# EAGLE design driver (EAGLE 6.6.0)
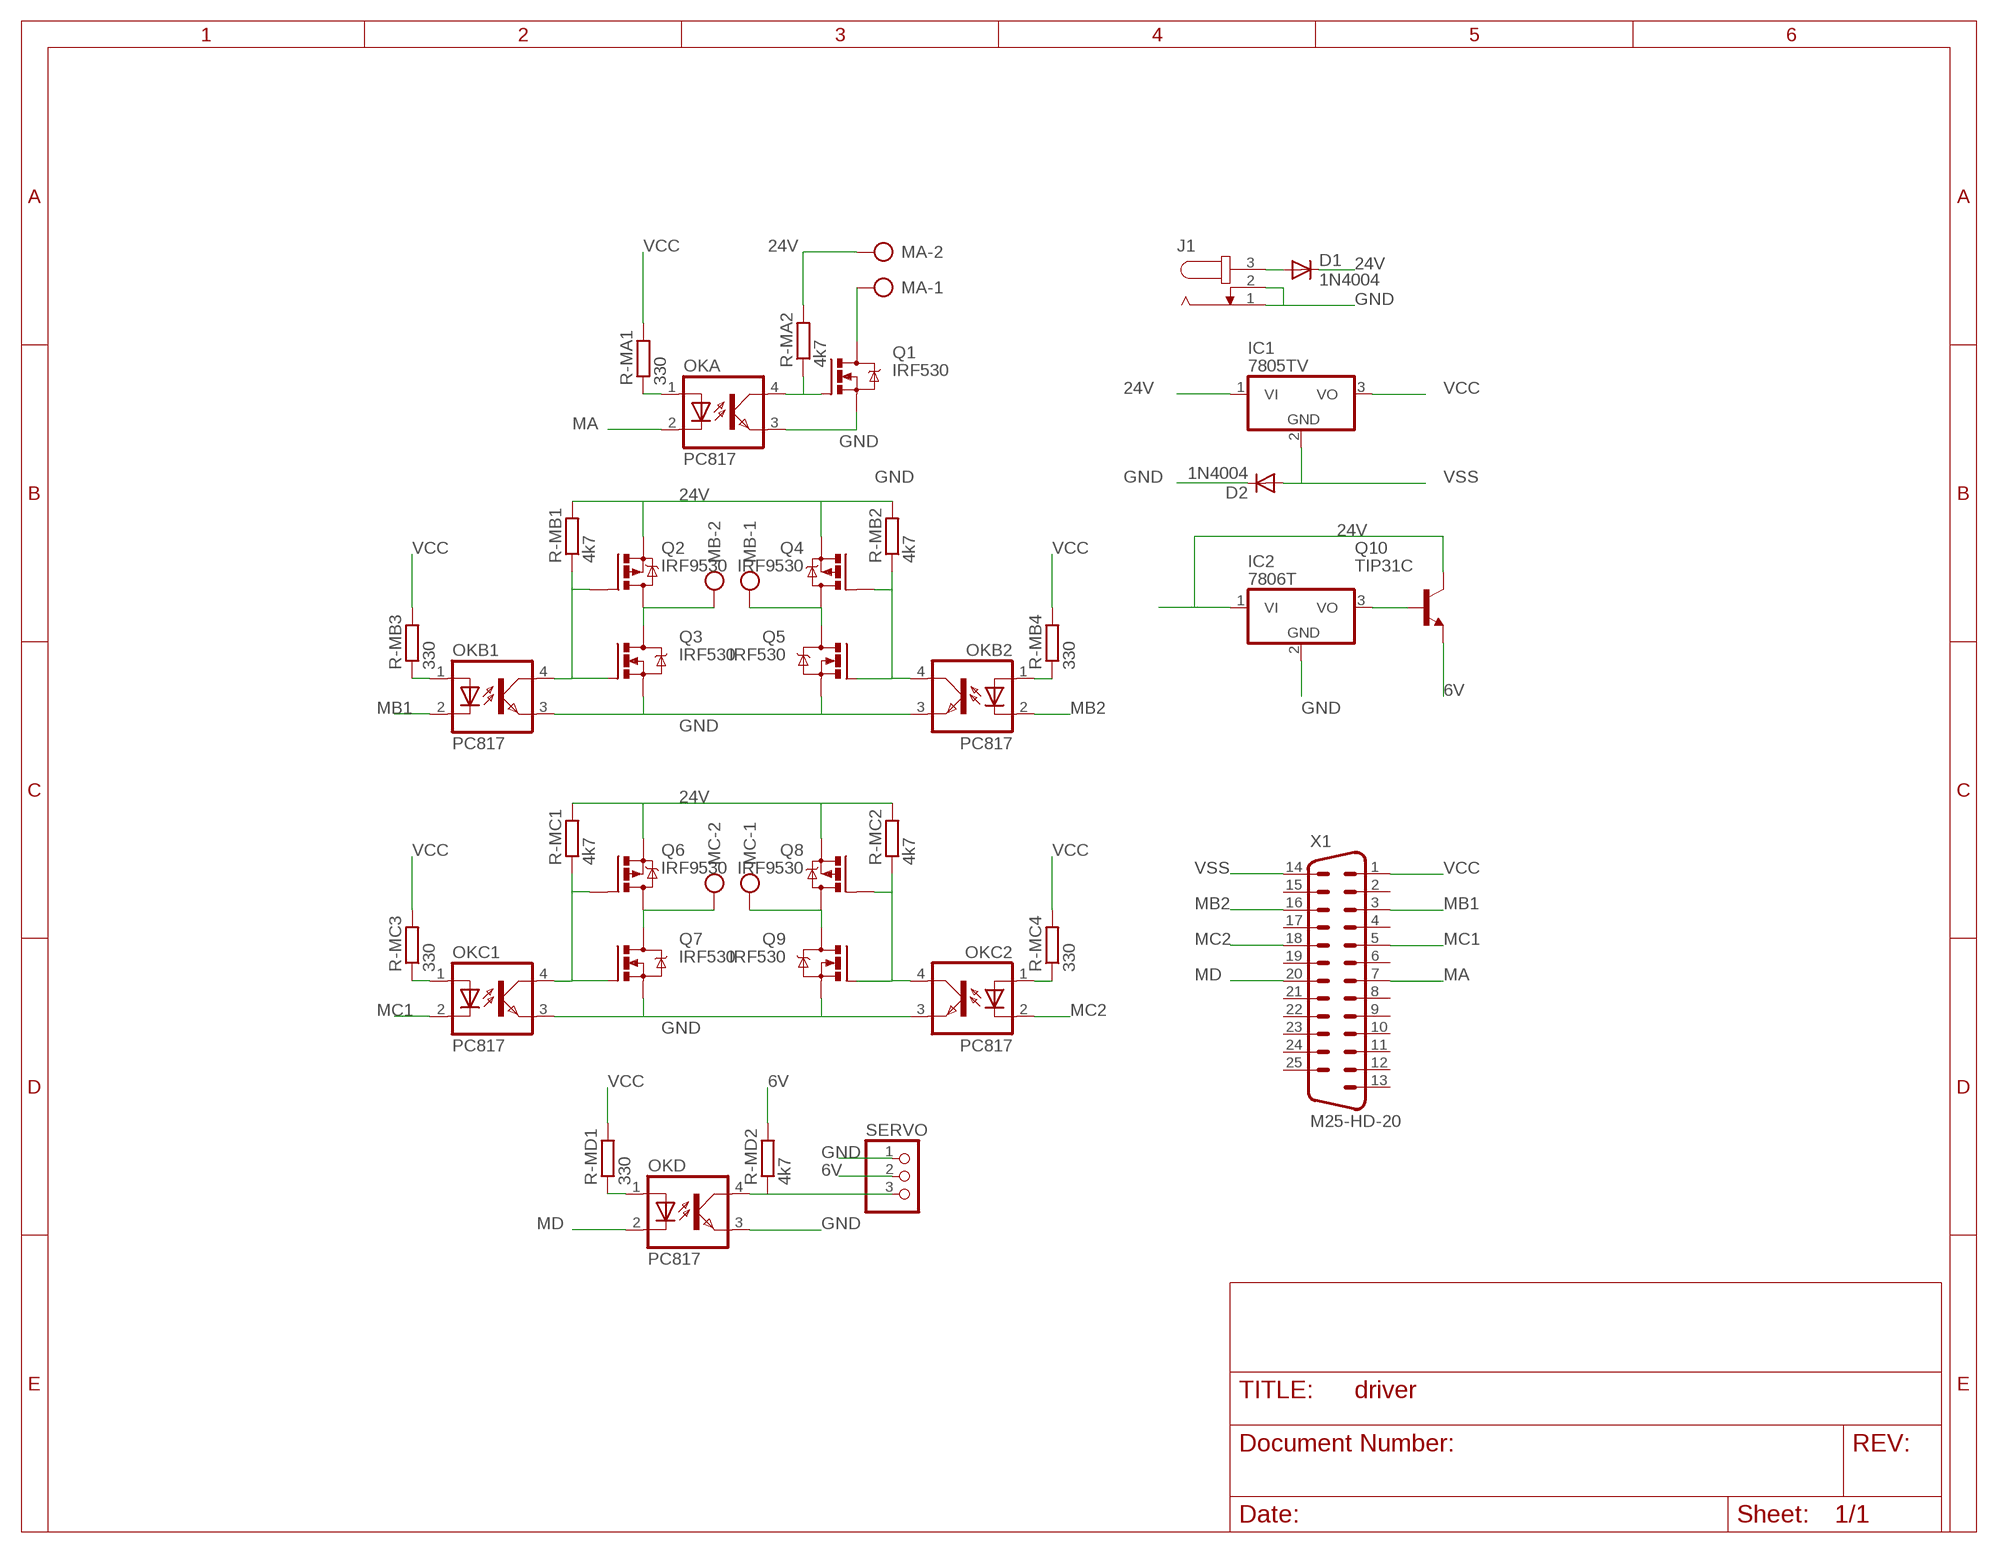
[diagram p0: schematic, sheet 1]

## Parts
D1  1N4004  [DO41-10]
D2  1N4004  [DO41-10]
IC1  7805TV  [TO220V]
IC2  7806T  [TO220H]
J1  JACK-PLUG0  [SPC4077]
MA  AK500/2  [AK500/2]
MB  AK500/2  [AK500/2]
MC  AK500/2  [AK500/2]
OKA  PC817  [DIL04]
OKB1  PC817  [DIL04]
OKB2  PC817  [DIL04]
OKC1  PC817  [DIL04]
OKC2  PC817  [DIL04]
OKD  PC817  [DIL04]
Q1  IRF530  [TO220BV]
Q2  IRF9530  [TO220BV]
Q3  IRF530  [TO220BV]
Q4  IRF9530  [TO220BV]
Q5  IRF530  [TO220BV]
Q6  IRF9530  [TO220BV]
Q7  IRF530  [TO220BV]
Q8  IRF9530  [TO220BV]
Q9  IRF530  [TO220BV]
Q10  TIP31C  [TO220]
R-MA1  330  R-EU_0204/7  [0204/7]
R-MA2  4k7  R-EU_0204/7  [0204/7]
R-MB1  4k7  R-EU_0204/7  [0204/7]
R-MB2  4k7  R-EU_0204/7  [0204/7]
R-MB3  330  R-EU_0204/7  [0204/7]
R-MB4  330  R-EU_0204/7  [0204/7]
R-MC1  4k7  R-EU_0204/7  [0204/7]
R-MC2  4k7  R-EU_0204/7  [0204/7]
R-MC3  330  R-EU_0204/7  [0204/7]
R-MC4  330  R-EU_0204/7  [0204/7]
R-MD1  330  R-EU_0204/7  [0204/7]
R-MD2  4k7  R-EU_0204/7  [0204/7]
SERVO  PINHD-1X3  [1X03]
X1  M25-HD-20  [M25-HD-20]

## Nets
6V: Q10.3(E) R-MD2.2 SERVO.2
24V: D1.C IC1.1(VI) IC2.1(VI) MA.2 Q2.S Q4.S Q6.S Q8.S Q10.2(C) R-MA2.2 R-MB1.2 R-MB2.2 R-MC1.2 R-MC2.2
GND: D2.C IC2.2(GND) J1.1 J1.2 OKA.3(EMIT) OKB1.3(EMIT) OKB2.3(EMIT) OKC1.3(EMIT) OKC2.3(EMIT) OKD.3(EMIT) Q1.S Q3.S Q5.S Q7.S Q9.S SERVO.1
MA: OKA.2(C) X1.7
MB1: OKB1.2(C) X1.3
MB2: OKB2.2(C) X1.16
MC1: OKC1.2(C) X1.5
MC2: OKC2.2(C) X1.18
MD: OKD.2(C) X1.20
MD-SERVO: OKD.4(COL) R-MD2.1 SERVO.3
N$1: OKA.4(COL) Q1.G R-MA2.1
N$2: OKA.1(A) R-MA1.1
N$3: MB.2 Q2.D Q3.D
N$4: MA.1 Q1.D
N$5: MB.1 Q4.D Q5.D
N$6: OKB1.1(A) R-MB3.1
N$7: OKB2.1(A) R-MB4.1
N$8: MC.2 Q6.D Q7.D
N$9: OKB2.4(COL) Q4.G Q5.G R-MB2.1
N$10: OKB1.4(COL) Q2.G Q3.G R-MB1.1
N$11: MC.1 Q8.D Q9.D
N$12: OKC2.4(COL) Q8.G Q9.G R-MC2.1
N$13: OKC1.4(COL) Q6.G Q7.G R-MC1.1
N$14: OKC1.1(A) R-MC3.1
N$15: OKC2.1(A) R-MC4.1
N$16: OKD.1(A) R-MD1.1
N$17: D1.A J1.3
N$19: IC2.3(VO) Q10.1(B)
VCC: IC1.3(VO) R-MA1.2 R-MB3.2 R-MB4.2 R-MC3.2 R-MC4.2 R-MD1.2 X1.1
VSS: D2.A IC1.2(GND) X1.14
Unconnected: X1.2 X1.4 X1.6 X1.8 X1.9 X1.10 X1.11 X1.12 X1.13 X1.15 X1.17 X1.19 X1.21 X1.22 X1.23 X1.24 X1.25

## Library data of the parts
D1 D2 = adafruit2:1N4004: DIODE General purpose 1N400x type rectifier (With bigger pads) http://www.ladyada.net/library/pcb/eaglelibrary.html
IC1 IC2 = linear:78*: Positive VOLTAGE REGULATOR Source: http://cache.national.com/ds/LM/LM78L05.pdf http://www.fairchildsemi.com/ds/LM/LM7805.pdf
J1 = con-jack:JACK-PLUG: DC POWER JACK Power Jack, DC, Right Angle, Through Hole, Rated 5A at 16VDC, PC Terminals Distributor: Farnell (www.Farnell.de) Drawing: 84N1161.pdf / 84N1162.pdf Manufacturer: SPC Technology (www.spctechnology.com) Type: SPC4077 / SPC 4078; OC_FARNELL: unknown; OC_NEWARK: unknown
MA MB MC = con-ptr500:AK500/2: CONNECTOR; OC_FARNELL: unknown; OC_NEWARK: unknown
OKA OKB1 OKB2 OKC1 OKC2 OKD = optocoupler:PC817: SHARP OPTO COUPLER; MPN: PC817X4J000F; OC_FARNELL: 9707727; OC_NEWARK: 97K7059
Q1 Q3 Q5 Q7 Q9 = transistor-power:IRF530: HEXFET Power MOSFET
Q2 Q4 Q6 Q8 = transistor-power:IRF9530: P-CHANNEL HEXFET POWER-MOS-FET Source: http://www.irf.com/product-info/datasheets/data/irf9530.pdf
Q10 = transistor-npn:TIP31C*: NPN Transistor
R-MA1 R-MA2 R-MB1-R-MB4 R-MC1-R-MC4 R-MD1 R-MD2 = resistor:R-EU_: RESISTOR, European symbol
SERVO = adafruit2:PINHD-1X3: PIN HEADER
X1 = con-subd:M25-HD-20: HD-20 Front Metal-Shell Right-Angle Posted Connectors 318 Mount 5747846-6 Source: http://catalog.tycoelectronics.com/TE/bin/TE.Connect?C=1&M=BYPN&TCPN=5747846-6&RQPN=5747846-6; OC_FARNELL: unknown; OC_NEWARK: unknown

## Board
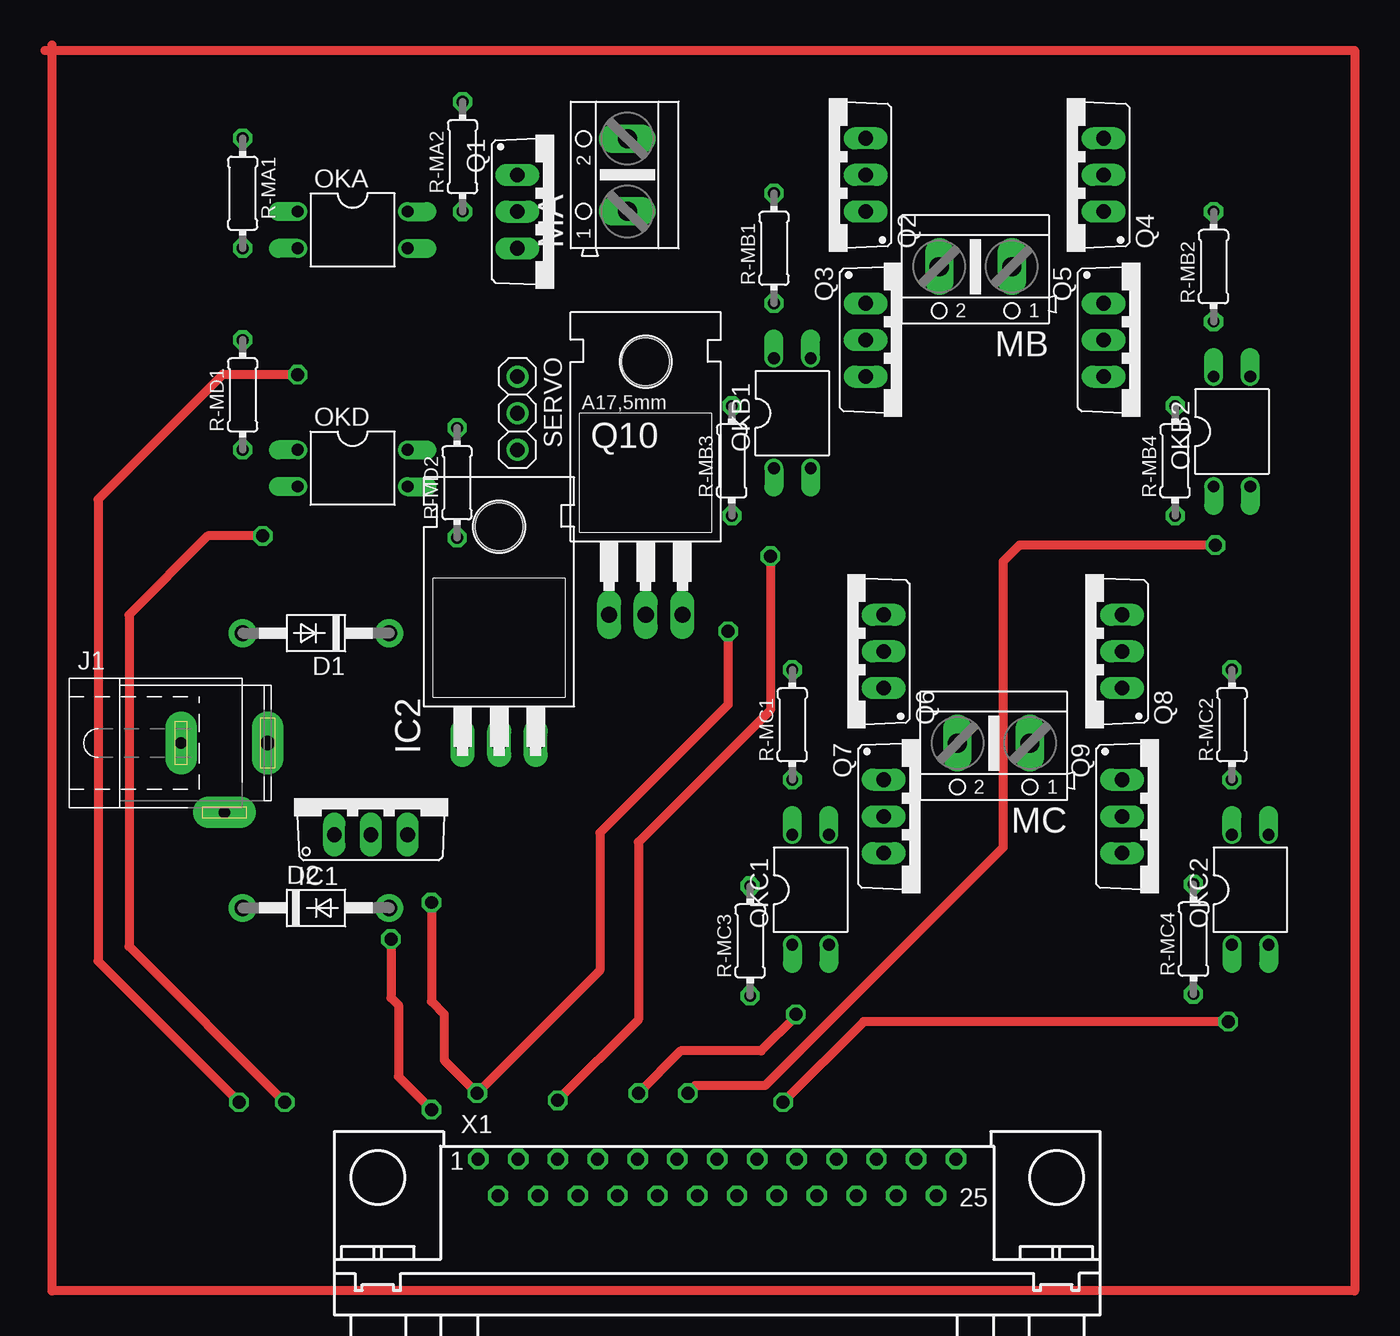
[diagram p1: board, top side]
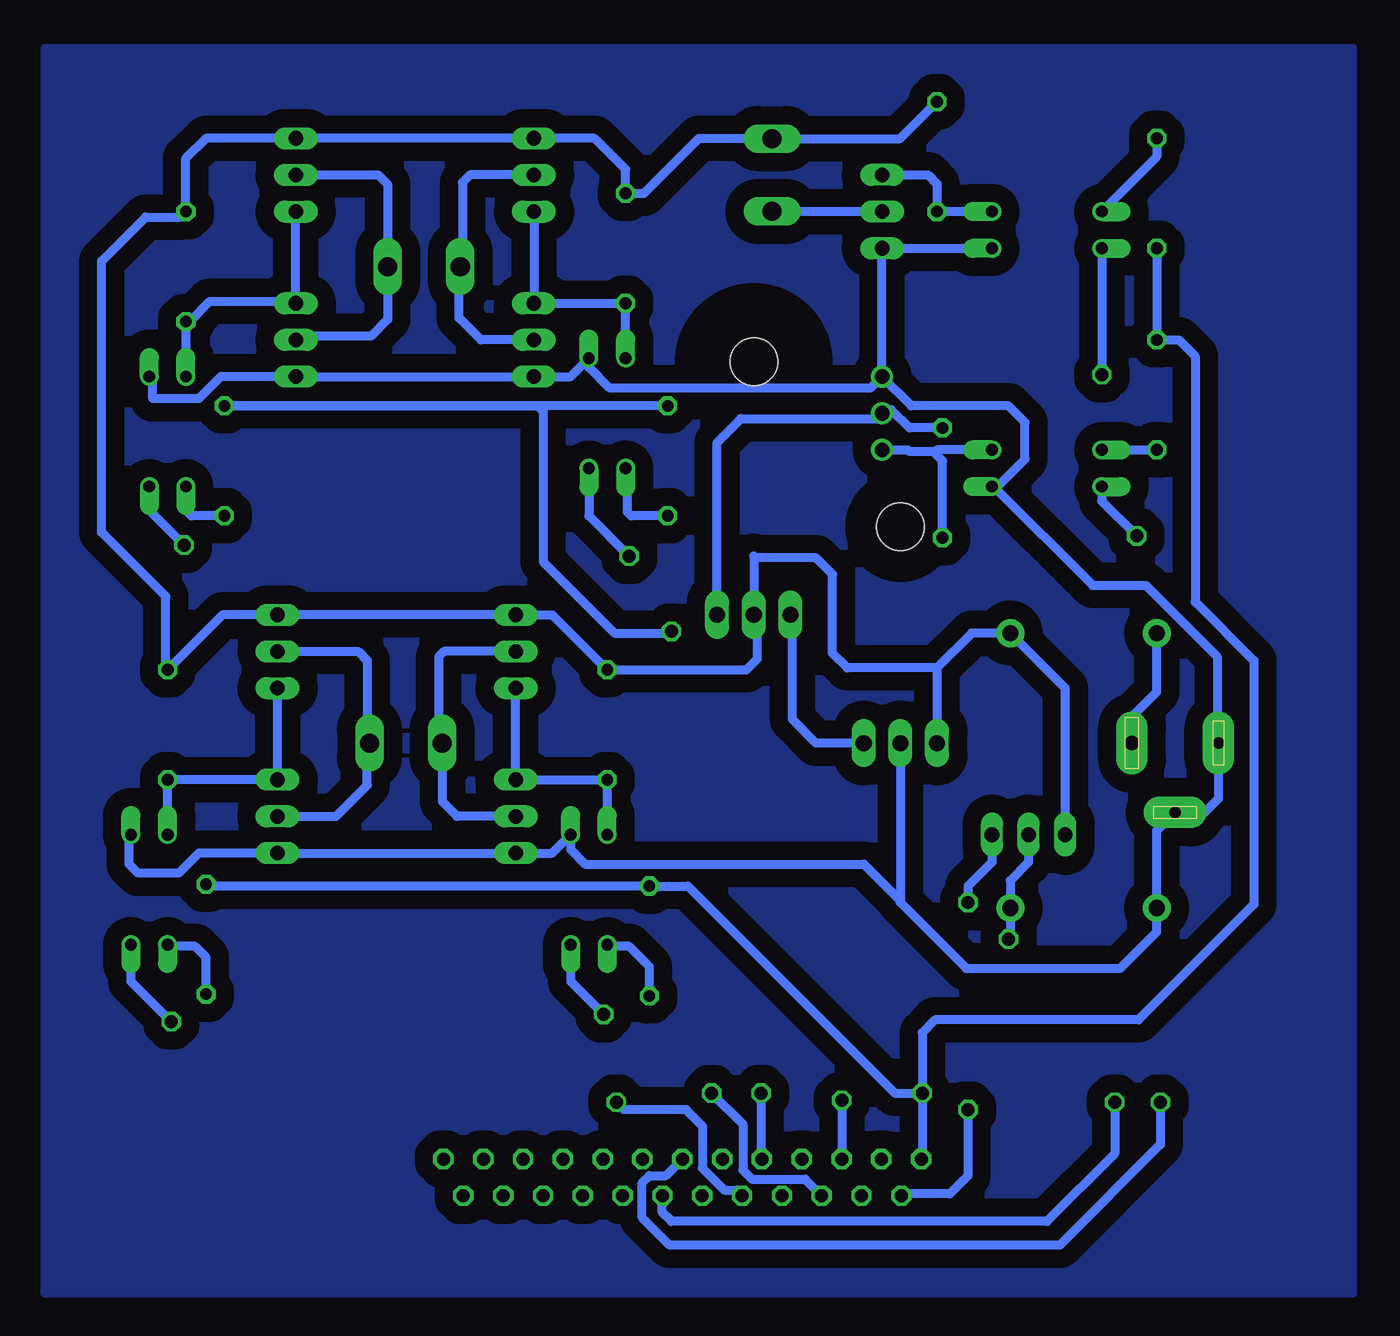
[diagram p2: board, bottom side, seen from below]

No outline drawn. Coordinates in mm, seen from the top.
Copper layers (1*16): Top 0.035mm / dielectric 1.5mm / Bottom 0.035mm
Design rules "default": minimum track width 10mil, minimum drill 24mil, track to track 8mil, track to pad 8mil, pad to pad 8mil, via to via 8mil, smd to smd 8mil, copper to edge 40mil, drill to drill 8mil, minimum pad ring 10mil, minimum via ring 8mil, stop-mask expansion 4mil, vias tented up to drill 0mil, thermal gap 10mil

### Footprints (pad centres in the part's own frame; a part is rotated, then mirrored left to right if it is on the bottom)
DO41-10 = drill 1.118 pad 1.93: A 5.08,0; C -5.08,0
TO220V = drill 1.016 long: 1 -2.54,-2.54; 2 0,-2.54; 3 2.54,-2.54
TO220H = drill 1.118 long: 1 -2.54,-10.16; 2 0,-10.16; 3 2.54,-10.16 | hole 3.302: 0,4.826
SPC4077 = drill 0.8 pad 2.184 long: 1 -3,0; 2 0,-4.8 | drill 1 pad 2.184 long: 3 3,0
AK500/2 = drill 1.321 long: 1 -2.515,0; 2 2.515,0
DIL04 = drill 0.813 offset: 1 -1.27,-3.81; 2 1.27,-3.81; 3 1.27,3.81; 4 -1.27,3.81
TO220BV = drill 1.016 long: D 0,-2.54; G -2.54,-2.54; S 2.54,-2.54
TO220 = drill 1.118 long: 1 -2.54,-6.35; 2 0,-6.35; 3 2.54,-6.35 | hole 3.302: 0,11.176
0204/7 = drill 0.813 octagon: 1 -3.81,0; 2 3.81,0
1X03 = drill 1.016: 1 -2.54,0; 2 0,0; 3 2.54,0
M25-HD-20 = drill 0.9 pad 1.3 octagon: 1 -16.561,1.27; 2 -13.792,1.27; 3 -11.049,1.27; 4 -8.28,1.27; 5 -5.512,1.27; 6 -2.769,1.27; 7 0,1.27; 8 2.769,1.27; 9 5.512,1.27; 10 8.28,1.27; 11 11.049,1.27; 12 13.792,1.27; 13 16.561,1.27; 14 -15.189,-1.27; 15 -12.421,-1.27; 16 -9.652,-1.27; 17 -6.909,-1.27; 18 -4.14,-1.27; 19 -1.372,-1.27; 20 1.372,-1.27; 21 4.14,-1.27; 22 6.909,-1.27; 23 9.652,-1.27; 24 12.421,-1.27; 25 15.189,-1.27

### Placement (x,y rotation side)
D1  11.43,40.64 180 top
D2  11.43,21.59 0 top
IC1  15.24,29.21 0 top
IC2  24.13,43.18 0 top
J1  5.08,33.02 0 top
MA  33.02,72.39 90 top
MB  57.15,66.04 180 top
MC  58.42,33.02 180 top
OKA  13.97,68.58 270 top
OKB1  44.45,55.88 0 top
OKB2  74.93,54.61 0 top
OKC1  45.72,22.86 0 top
OKC2  76.2,22.86 0 top
OKD  13.97,52.07 270 top
Q1  27.94,69.85 270 top
Q2  46.99,72.39 90 top
Q3  52.07,60.96 270 top
Q4  63.5,72.39 90 top
Q5  68.58,60.96 270 top
Q6  48.26,39.37 90 top
Q7  53.34,27.94 270 top
Q8  64.77,39.37 90 top
Q9  69.85,27.94 270 top
Q10  34.29,48.26 0 top
R-MA1  6.35,71.12 270 top
R-MA2  21.59,73.66 90 top
R-MB1  43.18,67.31 90 top
R-MB2  73.66,66.04 90 top
R-MB3  40.26,52.58 90 top
R-MB4  70.99,52.58 90 top
R-MC1  44.45,34.29 90 top
R-MC2  74.93,34.29 90 top
R-MC3  41.53,19.3 90 top
R-MC4  72.26,19.43 90 top
R-MD1  6.35,57.15 90 top
R-MD2  21.21,51.05 90 top
SERVO  25.4,55.88 270 top
X1  39.24,2.92 0 top

### Tracks (layer width: path | path; a pad name or v marks a point on that pad's centre or on a via)
6V
  Bottom 0.61: Q10.3 36.83,53.85 35.18,55.5 25.78,55.5 SERVO.2 25.15,56.13 24.77,56.13 23.5,54.86 R-MD2.2
24V
  Bottom 0.61: R-MA2.2 24.16,74.91 MA.2 33.05,74.93 38.1,74.93 41.91,71.12 R-MB1.2 43.18,72.77 45.34,74.93 Q2.S Q4.S 72.26,74.93 73.66,73.53 R-MB2.2 74.04,69.47 76.45,69.47 79.5,66.42 79.5,47.62 75.06,43.18 75.06,37.97 R-MC2.2 71.12,41.91 Q8.S Q6.S 48.26,41.91 R-MC1.2 34.8,38.1 34.04,38.86 34.04,41.66 Q10.2 34.29,45.97 34.16,45.85 29.97,45.85 28.83,44.7 28.83,39.24 27.81,38.23 21.59,38.23 | 21.59,38.23 19.18,40.64 D1.C 12.7,36.83 IC1.1 | 21.59,38.23 IC2.1
GND
  Bottom 0.61: OKA.3 Q1.S SERVO.1 | OKB2.3 75.95,58.17 75.95,56.9 72.77,56.9 71.25,58.42 Q5.S Q3.S 46.99,58.42 OKB1.3 45.72,59.05 44.32,57.66 26.16,57.66 SERVO.1 | SERVO.1 23.37,56.39 16.64,56.39 15.49,55.24 15.49,52.7 17.4,50.8 OKD.3 17.65,50.8 10.79,43.94 7.11,43.94 2.16,38.99 2.16,33.1 J1.1 2.08,29.16 3.05,28.19 5.05,28.19 J1.2 6.35,26.95 D2.C 6.35,19.94 8.89,17.4 19.56,17.4 24.13,21.97 24.13,22.1 | IC2.2 24.13,22.1 | 24.13,22.1 26.67,24.64 45.97,24.64 46.99,25.65 OKC1.3 48.26,25.4 Q7.S Q9.S 72.77,25.4 74.17,24 76.96,24 77.6,24.64 77.6,26.54 OKC2.3
MA  (via drill 0.9)
  Top 0.61: v10.16,58.55 4.95,58.55 -3.68,49.91 -3.68,17.91 v6.1,8.13
  Bottom 0.61: OKA.2 v10.16,58.55 | v6.1,8.13 6.1,5.21 13.08,-1.78 40.13,-1.78 42.04,0.13 42.04,2.54 41.53,3.05 40.39,3.05 X1.7
MB1  (via drill 0.9)
  Top 0.61: v42.93,45.97 42.93,35.31 33.78,26.16 33.78,13.84 v28.19,8.26
  Bottom 0.61: OKB1.2 45.72,48.77 v42.93,45.97 | v28.19,8.26 X1.3
MB2  (via drill 0.9)
  Top 0.61: v73.79,46.74 60.2,46.74 59.05,45.59 59.05,25.78 42.55,9.27 37.72,9.27 v37.21,8.76
  Bottom 0.61: OKB2.2 76.2,49.15 v73.79,46.74 | v37.21,8.76 35.05,6.6 35.05,3.43 34.42,2.79 30.73,2.79 X1.16
MC1  (via drill 0.9)
  Top 0.61: v44.7,14.22 44.7,14.1 42.29,11.68 36.7,11.68 v33.78,8.76
  Bottom 0.61: OKC1.2 46.99,16.51 v44.7,14.22 | v33.78,8.76 33.78,4.24 X1.5
MC2  (via drill 0.9)
  Top 0.61: v74.68,13.72 49.4,13.72 v43.81,8.13
  Bottom 0.61: OKC2.2 77.47,16.51 v74.68,13.72 | X1.18 35.48,2.03 36.32,2.03 37.85,3.56 37.85,6.48 38.99,7.62 43.31,7.62 v43.81,8.13
MD  (via drill 0.9)
  Top 0.61: v7.75,47.37 3.94,47.37 -1.52,41.91 -1.52,18.92 v9.27,8.13
  Bottom 0.61: OKD.2 10.16,49.78 v7.75,47.37 | v9.27,8.13 9.27,4.57 13.97,-0.13 40.01,-0.13 40.64,0.51 40.64,1.63 X1.20
MD-SERVO
  Bottom 0.61: SERVO.3 23.62,53.34 23.5,53.21 21.84,53.21 21.78,53.15 | R-MD2.1 21.21,52.58 21.78,53.15 | OKD.4 21.59,53.34 21.78,53.15
N$1
  Bottom 0.61: OKA.4 R-MA2.1 21.59,71.75 22.23,72.39 Q1.G
N$2
  Bottom 0.61: R-MA1.1 6.35,73.66 OKA.1
N$3
  Bottom 0.61: Q2.D 53.98,72.39 54.48,71.88 54.48,66.19 MB.2 54.74,65.94 54.74,62.48 53.21,60.96 Q3.D
N$4
  Bottom 0.61: Q1.D 32.99,69.85 MA.1
N$5
  Bottom 0.61: Q4.D 60.33,72.39 59.69,71.75 59.69,66.06 MB.1 59.66,62.38 60.83,61.21 65.79,61.21 Q5.D
N$6
  Bottom 0.61: R-MB3.1 42.8,48.77 43.05,49.02 43.05,51.94 OKB1.1
N$7
  Bottom 0.61: R-MB4.1 73.28,48.77 73.79,49.28 73.79,50.67 OKB2.1
N$8
  Bottom 0.61: Q6.D 55.75,39.37 56.13,38.99 56.13,33.25 MC.2 55.88,32.99 55.88,28.96 54.86,27.94 Q7.D
N$9
  Bottom 0.61: Q4.G Q5.G 66.17,63.63 72.01,63.63 73.41,62.23 R-MB2.1 OKB2.4
N$10
  Bottom 0.61: Q2.G Q3.G R-MB1.1 OKB1.4
N$11
  Bottom 0.61: Q8.D 61.72,39.37 61.09,38.73 61.09,33.17 MC.1 61.09,32.87 61.09,30.1 63.25,27.94 Q9.D
N$12
  Bottom 0.61: Q8.G Q9.G R-MC2.1 OKC2.4
N$13
  Bottom 0.61: Q6.G Q7.G R-MC1.1 OKC1.4
N$14
  Bottom 0.61: R-MC3.1 41.53,17.53 42.93,18.92 44.32,18.92 OKC1.1
N$15
  Bottom 0.61: R-MC4.1 72.26,18.16 73.03,18.92 74.8,18.92 OKC2.1
N$16
  Bottom 0.61: OKD.1 R-MD1.1
N$17
  Bottom 0.61: J1.3 8.08,34.85 6.35,36.58 D1.A
N$18
  pour Bottom (isolate 1.27): -7.24,81.15 83.44,81.15 83.44,-5.08 -7.24,-5.08
N$19
  Bottom 0.61: IC2.3 29.97,33.02 31.62,34.67 31.62,41.78 Q10.1
N$20
  Top 0.61: -7.37,81.03 83.44,81.03 83.44,-4.95 -6.86,-4.95 -6.86,81.41
VCC  (via drill 0.9)
  Top 0.61: v19.43,21.97 19.43,15.11 20.32,14.22 20.32,11.05 v22.61,8.76 31.11,17.27 31.11,26.8 40.01,35.69 v40.01,40.77
  Bottom 0.61: R-MA1.2 R-MD1.2 4.83,60.96 3.68,59.82 3.68,42.8 -0.38,38.73 -0.38,21.84 7.62,13.84 21.72,13.84 22.61,12.95 v22.61,8.76 | R-MB3.2 R-MB4.2 49.28,56.39 48.9,56.01 48.9,45.59 43.94,40.64 40.13,40.64 v40.01,40.77 | R-MC4.2 72.14,23.11 R-MC3.2 38.86,23.11 24.51,8.76 v22.61,8.76 | IC1.3 17.78,24.77 19.43,23.11 v19.43,21.97 | v22.61,8.76 22.61,4.27 X1.1
VSS  (via drill 0.9)
  Top 0.61: v16.64,19.43 16.64,15.37 17.14,14.86 17.14,9.91 v19.43,7.62
  Bottom 0.61: v16.64,19.43 16.51,19.56 D2.A 16.51,23.5 15.24,24.77 IC1.2 | v19.43,7.62 19.43,3.05 20.7,1.78 23.93,1.78 X1.14